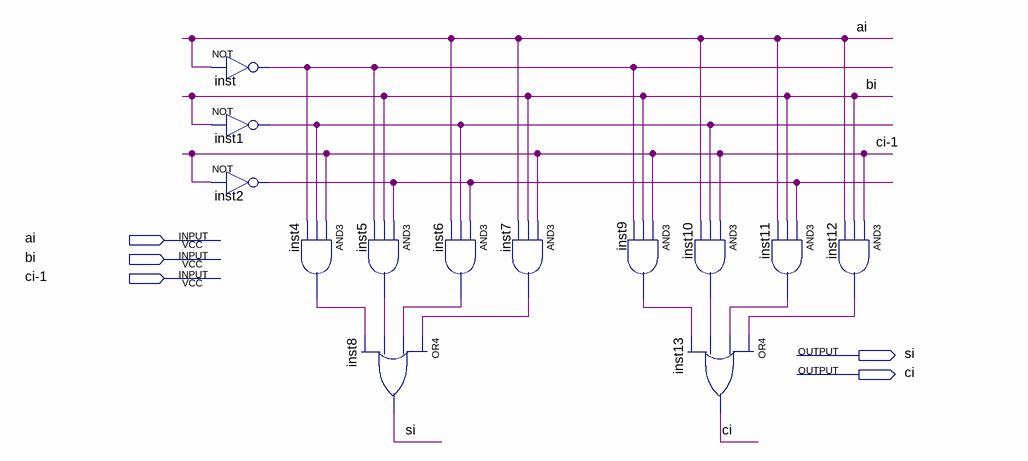
[diagram p0: schematic sheet]
// Quartus schematic qjq.bdf as structural Verilog: 13 symbols, 5 pins
module qjq (
  input  ai,
  input  bi,
  input  \ci-1 ,
  output si,
  output ci
);

  wire inst1_out, inst2_out, inst4_out, inst5_out, inst6_out, inst7_out, inst9_out, inst10_out, inst11_out,
       inst12_out, inst_out;

  not inst (inst_out, ai);
  not inst1 (inst1_out, bi);
  not inst2 (inst2_out, \ci-1 );
  and inst4 (inst4_out, \ci-1 , inst1_out, inst_out);
  and inst5 (inst5_out, inst2_out, bi, inst_out);
  or inst8 (si, inst7_out, inst6_out, inst5_out, inst4_out);
  and inst6 (inst6_out, inst2_out, inst1_out, ai);
  and inst7 (inst7_out, \ci-1 , bi, ai);
  and inst9 (inst9_out, \ci-1 , bi, inst_out);
  and inst10 (inst10_out, \ci-1 , inst1_out, ai);
  or inst13 (ci, inst12_out, inst11_out, inst10_out, inst9_out);
  and inst11 (inst11_out, inst2_out, bi, ai);
  and inst12 (inst12_out, \ci-1 , bi, ai);
endmodule
